# Altium schematic sheet POWER.SchDoc
size A4
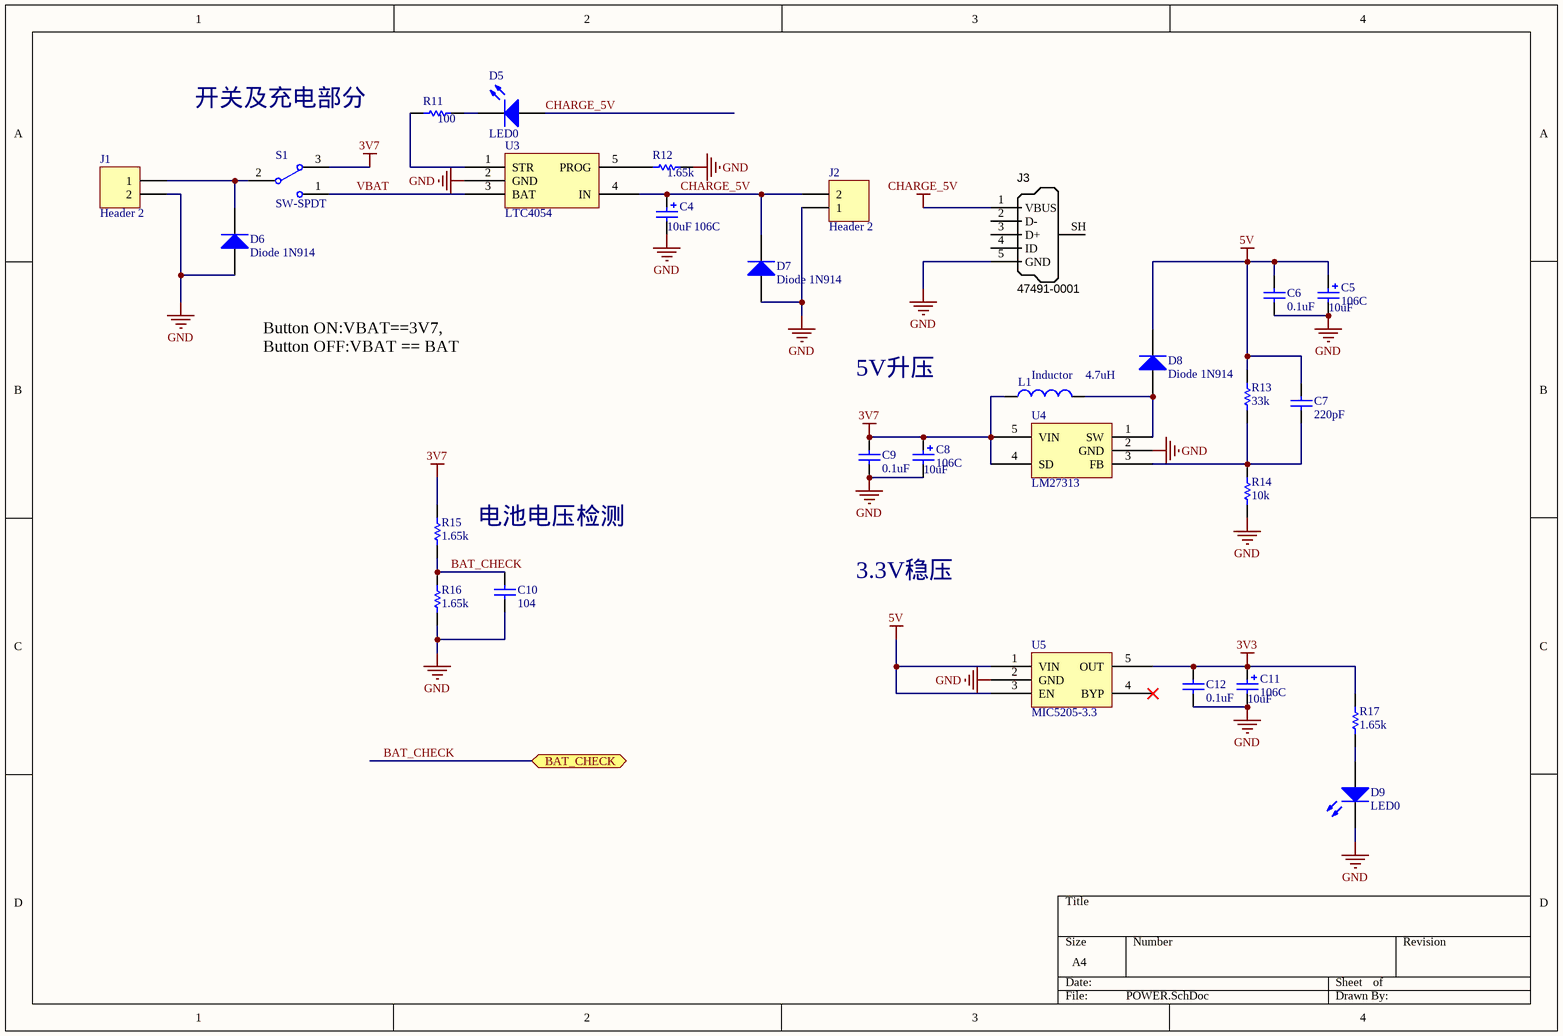
[diagram p0: POWER.SchDoc]

## Parts
C4  106C  value 10uF  [CAP_TAN_A1206]
C5  106C  value 10uF  [CAP_TAN_A1206]
C6  value 0.1uF  [CAP_0603]  (hidden comment: Cap)
C7  value 220pF  [CAP_0603]  (hidden comment: Cap)
C8  106C  value 10uF  [CAP_TAN_A1206]
C9  value 0.1uF  [CAP_0603]  (hidden comment: Cap)
C10  value 104  [CAP_0603]  (hidden comment: Cap)
C11  106C  value 10uF  [CAP_TAN_A1206]
C12  value 0.1uF  [CAP_0603]  (hidden comment: Cap)
D5  LED0  [LED_0603_RED]
D6  Diode 1N914  [SS14]
D7  Diode 1N914  [SS14]
D8  Diode 1N914  [SS14]
D9  LED0  [LED_0603_RED]
J1  Header 2  [HDR1X2]
J2  Header 2  [HDR1X2]
J3  Manufacturer Part Number 1: 47491-0001  [USB_MICRO_B]  (hidden comment: USB Micro Type B)
L1  Inductor  value 4.7uH  [IND_0805]
R11  value 100  [RES_0603]  (hidden comment: Res Semi)
R12  value 1.65k  [RES_0603]  (hidden comment: Res Semi)
R13  value 33k  [RES_0603]  (hidden comment: Res Semi)
R14  value 10k  [RES_0603]  (hidden comment: Res Semi)
R15  value 1.65k  [RES_0603]  (hidden comment: Res Semi)
R16  value 1.65k  [RES_0603]  (hidden comment: Res Semi)
R17  value 1.65k  [RES_0603]  (hidden comment: Res Semi)
S1  SW-SPDT  [SW_SPDT1X3_180_xx]
U3  LTC4054  [SOT23-5]
U4  LM27313  [SOT23-5]
U5  MIC5205-3.3  [SOT23-5]

## Ports
BAT_CHECK

## Nets
3V3: C11.1 C12.2 R17.2 U5.5(OUT)
3V7: C8.1 C9.2 L1.1 R15.2 S1.3 U4.4(SD) U4.5(VIN)
5V: C5.1 C6.2 C7.2 D8.2(K) R13.2 U5.1(VIN) U5.3(EN)
CHARGE_5V: C4.1 D5.1(A) D7.2(K) J2.2 J3.1(VBUS) U3.4(IN)
GND: C4.2 C5.2 C6.1 C8.2 C9.1 C10.1 C11.2 C12.1 D6.1(A) D7.1(A) D9.2(K) J1.2 J2.1 J3.5(GND) R12.2 R14.1 R16.1 U3.2(GND) U4.2(GND) U5.2(GND)
BAT_CHECK: C10.2 R15.1 R16.2 ; port BAT_CHECK
VBAT: S1.1 U3.3(BAT)
NetC7_1: C7.1 R13.1 R14.2 U4.3(FB)
NetD5_2: D5.2(K) R11.2
NetD6_2: D6.2(K) J1.1 S1.2
NetD8_1: D8.1(A) L1.2 U4.1(SW)
NetD9_1: D9.1(A) R17.1
NetR11_1: R11.1 U3.1(STR)
NetR12_1: R12.1 U3.5(PROG)

Not connected (* = marked no-connect by the designer): J3 2(D-) 3(D+) 4(ID) SH(Shell); U5 4(BYP)*

## Notes on the sheet
- 开关及充电部分
- Button ON:VBAT==3V7,
  Button OFF:VBAT == BAT
- 5V升压
- 电池电压检测
- 3.3V稳压

## Library data of the parts
C4 C5 C8 C11 = Cap Pol2: Polarized Capacitor (Axial); Published: 8-Jun-2000; LatestRevisionDate: 17-Jul-2002; LatestRevisionNote: Re-released for DXP Platform.; PackageReference: POLAR0.8; Publisher: Altium Limited; PackageDescription: Polarized Capacitor; 2 Leads
C6 C7 C9 C10 C12 = Cap: Capacitor; Published: 8-Jun-2000; LatestRevisionDate: 17-Jul-2002; LatestRevisionNote: Re-released for DXP Platform.; PackageReference: RAD-0.3; Publisher: Altium Limited; PackageDescription: Radial Cap, Thru-Hole; 2 Leads; 0.3 in Pin Spacing
D5 D9 = LED0: Typical INFRARED GaAs LED; Published: 8-Jun-2000; LatestRevisionDate: 08-Jul-2005; LatestRevisionNote: Mech Layer 1 removed.; PackageReference: LED-0; Publisher: Altium Limited; PackageDescription: LED; 2 Leads
D6-D8 = Diode 1N914: High Conductance Fast Diode; Published: 8-Jun-2000; LatestRevisionDate: 17-Jul-2002; LatestRevisionNote: Re-released for DXP Platform.; DatasheetVersion: 1997; PackageReference: DO-35; Publisher: Altium Limited; PackageDescription: Diode, Axial; Body 3.8 x 1.9 mm (LxDia. max), Lead Dia. 0.53 mm (max); Code_JEDEC: DO-204-AH; ComponentLink1Description: Manufacturer Link; ComponentLink1URL: http://www.fairchildsemi.com/; ComponentLink2Description: Datasheet; ComponentLink2URL: http://www.fairchildsemi.com/ds/1N%2F1N4448.pdf
J1 J2 = Header 2: Header, 2-Pin; LatestRevisionDate: 17-Jul-2002; LatestRevisionNote: Re-released for DXP Platform.; Publisher: Altium Limited
J3 = USB_Micro_TypeB: Connector SMD USB Micro Type B middle mount; Manufacturer 1: Molex Inc; Package / Case: SMD; Supplier 1: Digi-Key; Supplier Part Number 1: WM17142CT-ND
L1 = Inductor: Code_IEC: 1005; Published: 8-Jun-2000; LatestRevisionDate: 29-May-2009; LatestRevisionNote: IPC-7351 Footprint Added.; PackageReference: 0402-A; Publisher: Altium Limited; PackageDescription: Chip Inductor; Code_JEITA: 0402
R11-R17 = Res Semi: Semiconductor Resistor; Published: 8-Jun-2000; LatestRevisionDate: 17-Jul-2002; LatestRevisionNote: Re-released for DXP Platform.; PackageReference: AXIAL-0.5; Publisher: Altium Limited; PackageDescription: Axial Device, Thru-Hole; 2 Leads; 0.5 in Pin Spacing
S1 = SW-SPDT: SPDT Subminiature Toggle Switch, Right Angle Mounting, Vertical Actuation; Published: 24-Mar-1999; LatestRevisionDate: 17-Dec-2003; LatestRevisionNote: Schematic revised, PCB Footprint replaced.; DatasheetVersion: 05-Dec-2000; PackageReference: TL36WW15050; Publisher: Altium Limited; PackageDescription: Switch; 4 Leads; ComponentLink1Description: Manufacturer Link; ComponentLink1URL: http://www.apem.com